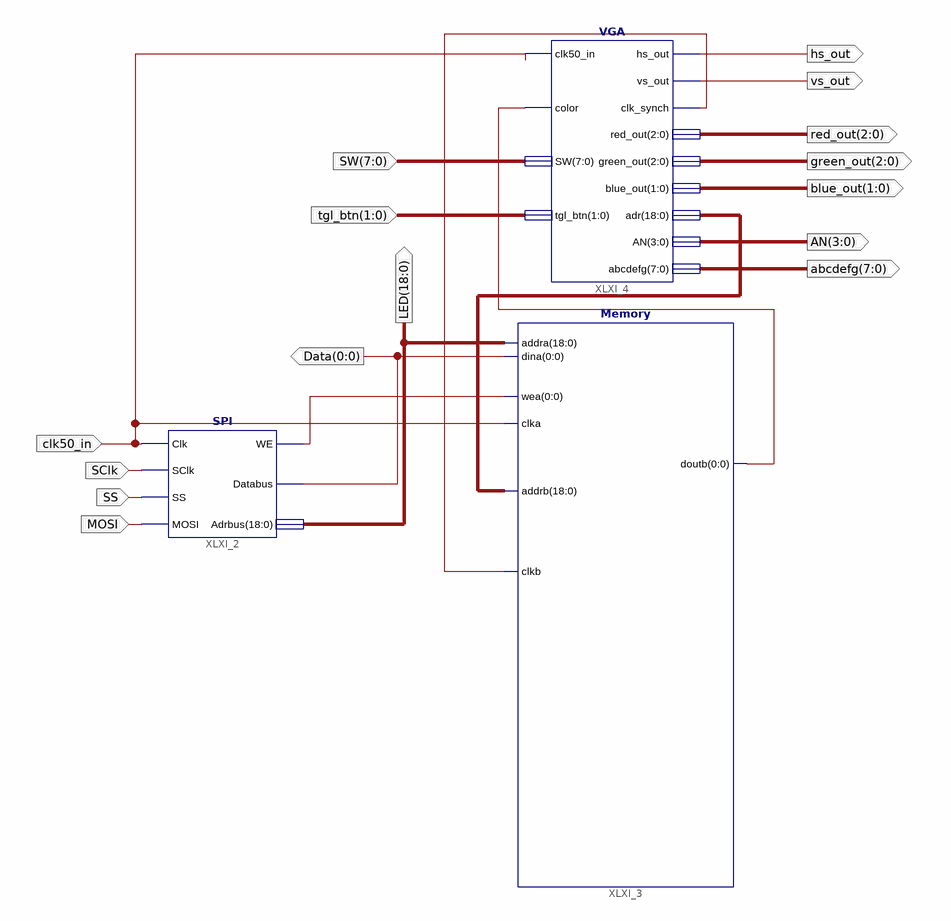
[diagram p0: schematic sheet 1]
// Xilinx ISE schematic Schem.sch (spartan3e) as structural Verilog: 3 symbols, 15 ports
module Schem (
  input  SClk,
  input  SS,
  input  MOSI,
  input  [7:0] SW,
  input  [1:0] tgl_btn,
  input  clk50_in,
  output hs_out,
  output vs_out,
  output [2:0] red_out,
  output [2:0] green_out,
  output [1:0] blue_out,
  output [0:0] Data,
  output [18:0] LED,
  output [3:0] AN,
  output [7:0] abcdefg
);

  wire XLXN_13;
  wire [0:0] XLXN_17, XLXN_27;
  wire [18:0] XLXN_11;

  SPI XLXI_2 (.Clk(clk50_in), .SClk(SClk), .SS(SS), .MOSI(MOSI), .WE(XLXN_17[0]), .Databus(Data[0]), .Adrbus(LED));
  Memory XLXI_3 (
    .addra(LED), .dina(Data[0]), .wea(XLXN_17[0]), .clka(clk50_in), .addrb(XLXN_11), .clkb(XLXN_13),
    .doutb(XLXN_27[0]));
  VGA XLXI_4 (
    .clk50_in(clk50_in), .color(XLXN_27[0]), .SW(SW), .tgl_btn(tgl_btn), .hs_out(hs_out), .vs_out(vs_out),
    .clk_synch(XLXN_13), .red_out(red_out), .green_out(green_out), .blue_out(blue_out), .adr(XLXN_11),
    .AN(AN), .abcdefg(abcdefg));
endmodule
